# EAGLE schematic Mbed Controller (EAGLE 6.4)
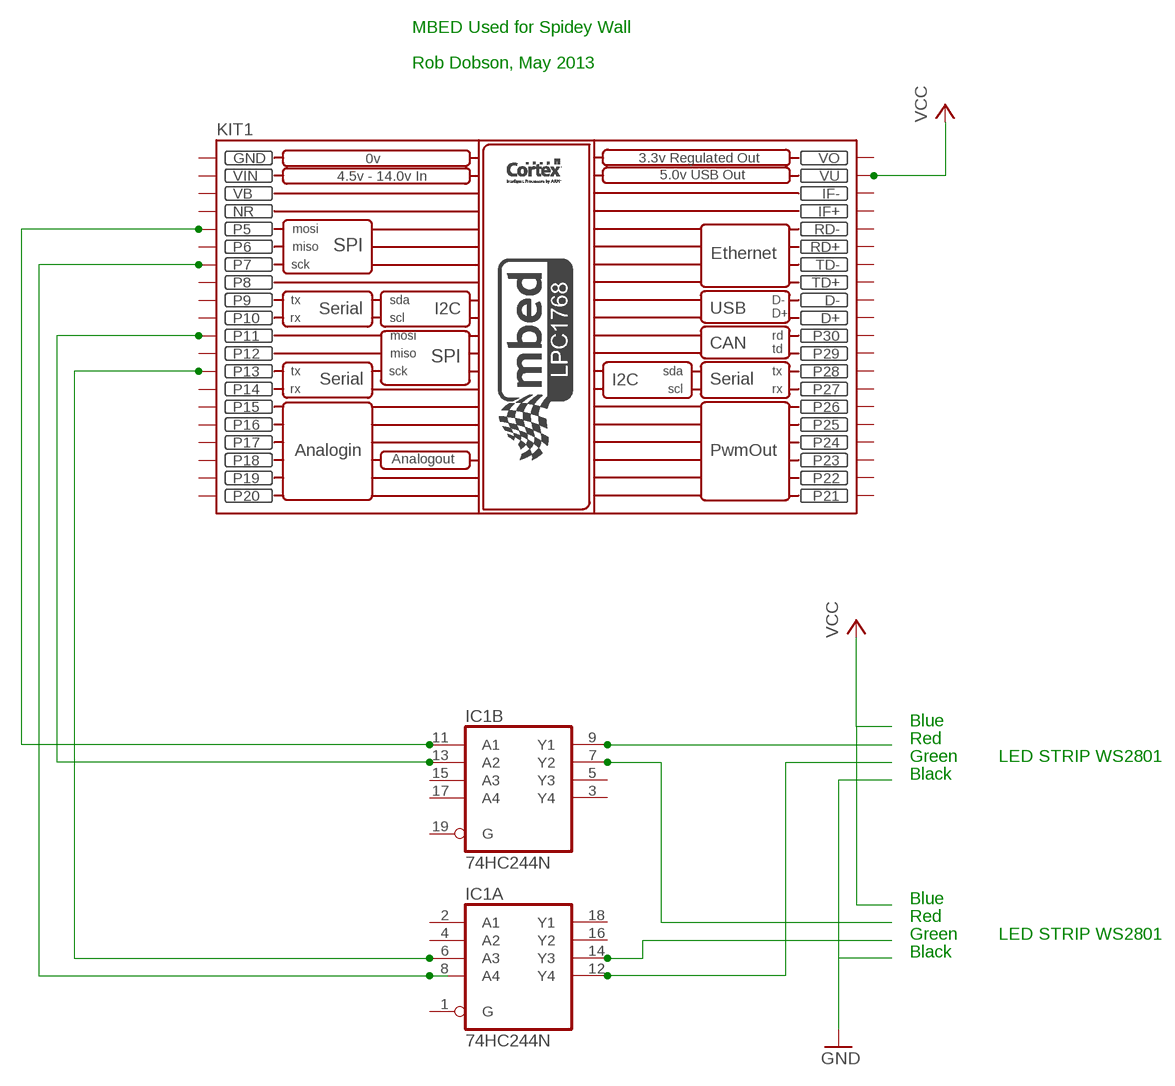
[diagram p0: schematic, sheet 1]

## Parts
IC1  74HC244N  [DIL20]
KIT1  MBED_NXP_LPC1768  [MBED-KIT]

## Nets
N$1: IC1.11(B:A1) KIT1.P$5(P5)
N$2: IC1.9(B:Y1)
N$3: IC1.12(A:Y4)
N$4: IC1.7(B:Y2)
N$5: IC1.14(A:Y3)
N$8: IC1.8(A:A4) KIT1.P$7(P7)
N$9: IC1.13(B:A2) KIT1.P$11(P11)
N$10: IC1.6(A:A3) KIT1.P$13(P13)
VCC: KIT1.VU
Unconnected: IC1.1(A:G) IC1.2(A:A1) IC1.3(B:Y4) IC1.4(A:A2) IC1.5(B:Y3) IC1.15(B:A3) IC1.16(A:Y2) IC1.17(B:A4) IC1.18(A:Y1) IC1.19(B:G) KIT1.D+ KIT1.D- KIT1.IF+ KIT1.IF- KIT1.P$6(P6) KIT1.P$8(P8) KIT1.P$9(P9) KIT1.P$10(P10) KIT1.P$12(P12) KIT1.P$14(P14) KIT1.P$15(P15) KIT1.P$16(P16) KIT1.P$17(P17) KIT1.P$18(P18) KIT1.P$19(P19) KIT1.P$20(P20) KIT1.P$21(P21) KIT1.P$22(P22) KIT1.P$23(P23) KIT1.P$24(P24) KIT1.P$25(P25) KIT1.P$26(P26) KIT1.P$27(P27) KIT1.P$28(P28) KIT1.P$29(P29) KIT1.P$30(P30) KIT1.RD+ KIT1.RD- KIT1.TD+ KIT1.TD-

## Notes on the sheet
- MBED Used for Spidey Wall
- Rob Dobson, May 2013
- Blue
- Red
- Green | LED STRIP WS2801
- Black
- Blue
- Red
- Green | LED STRIP WS2801
- Black

## Power pins joined to a net without a drawn wire
GND: IC1.10(P:GND) KIT1.GND
NR: KIT1.NR
VB: KIT1.VB
VCC: IC1.20(P:VCC)
VIN: KIT1.VIN
VO: KIT1.VOUT(VO)

## Library data of the parts
IC1 = 74xx-eu:74*244: Octal BUFFER and LINE DRIVER, 3-state
KIT1 = MBED_v2.1:MBED_NXP_LPC1768: Mbed LPC1768 - ARM CORTEX v2.1 * Schematic symbol is now placed in eagles's default raster. *The pads diameter are suitable for routing between mbed pins * mbed pads are 0.8 mm drill diameter. --------------------------------------------- Created by: Mohamed Yousry *Alexandria, Egypt *Email: mohamed.yousry@ieeegoldegypt.org